# Altium project Motor_Control_Unit_2023_Urban.PrjPcb
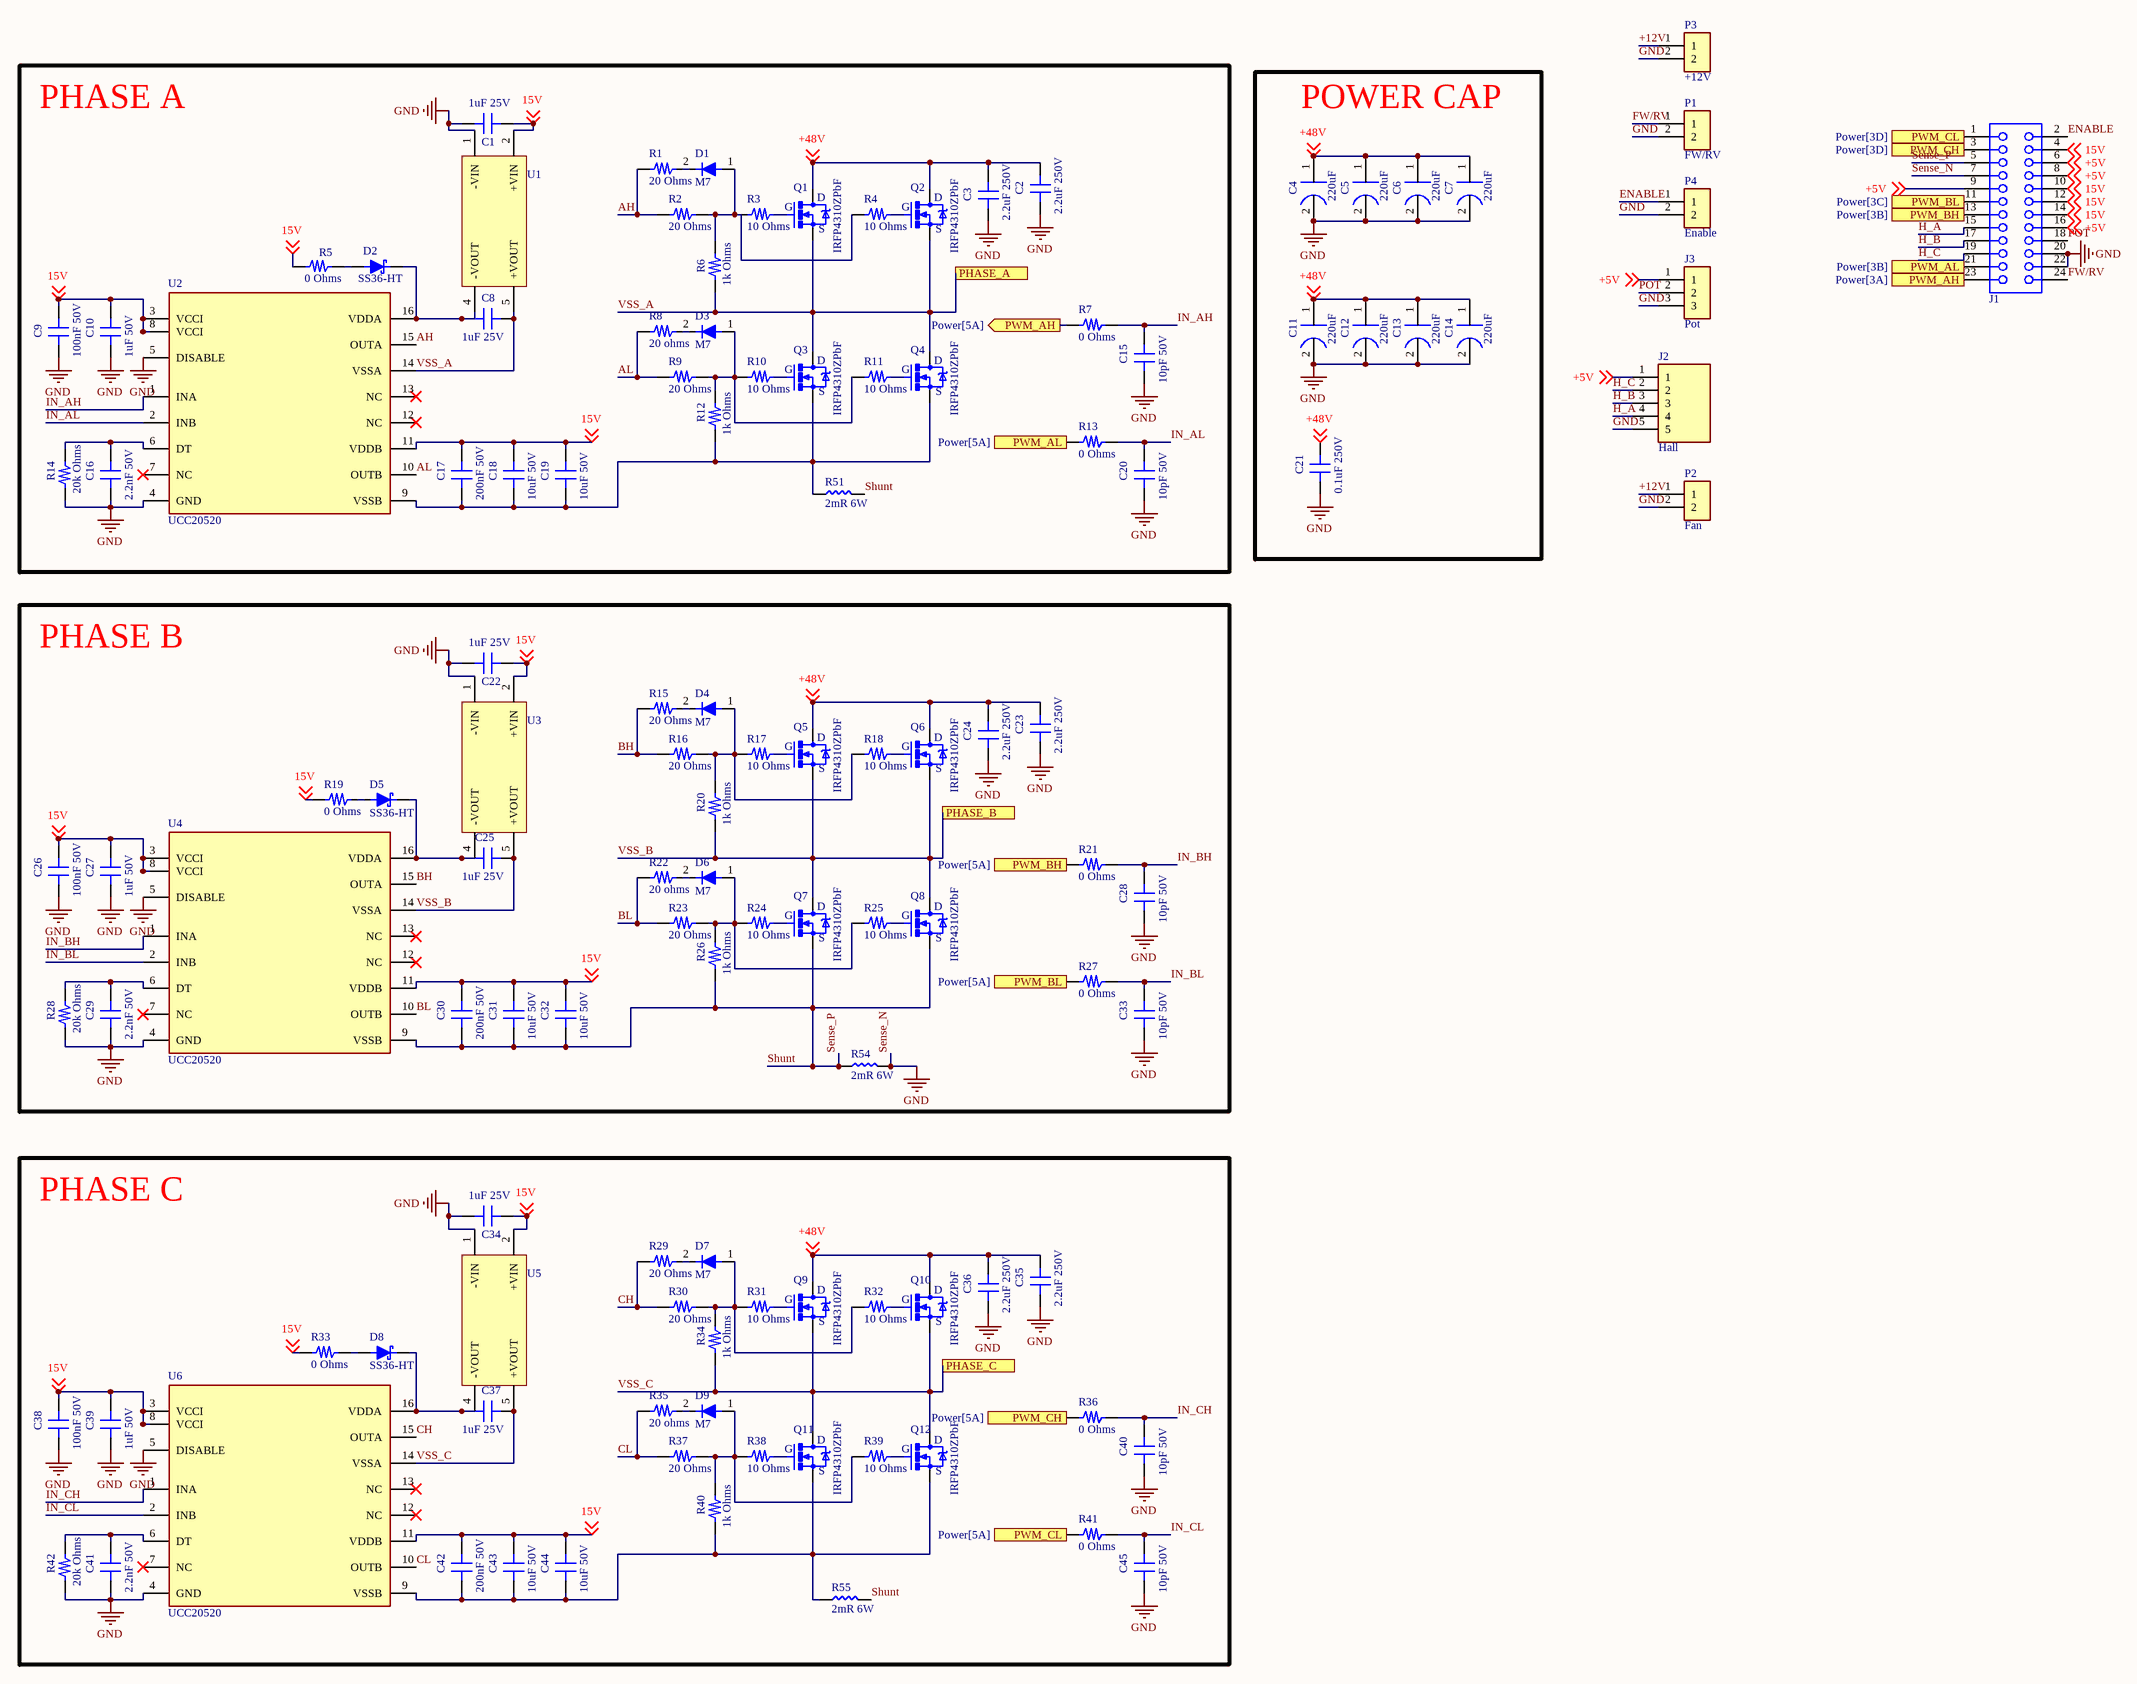
[diagram p0: Power.SchDoc]
2 sheets, 157 parts. Net scope: flat (ports and power ports of the same name join across sheets).
Board file: PCB.PcbDoc
Sheets:
  Power.SchDoc
  Regulator.SchDoc

## Sheet Power.SchDoc
size C; SheetNumber: 1; SheetTotal: 2

### Parts
C1  1uF 25V  [0805_CAP]
C2  2.2uF 250V  [0805_CAP]
C3  2.2uF 250V  [0805_CAP]
C4  220uF  [220uF 100V Cap]
C5  220uF  [220uF 100V Cap]
C6  220uF  [220uF 100V Cap]
C7  220uF  [220uF 100V Cap]
C8  1uF 25V  [0805_CAP]
C9  100nF 50V  [0805_CAP]
C10  1uF 50V  [0805_CAP]
C11  220uF  [220uF 100V Cap]
C12  220uF  [220uF 100V Cap]
C13  220uF  [220uF 100V Cap]
C14  220uF  [220uF 100V Cap]
C15  10pF 50V  [0805_CAP]
C16  2.2nF 50V  [0805_CAP]
C17  200nF 50V  [0805_CAP]
C18  10uF 50V  [0805_CAP]
C19  10uF 50V  [0805_CAP]
C20  10pF 50V  [0805_CAP]
C21  0.1uF 250V  [0805_CAP]
C22  1uF 25V  [0805_CAP]
C23  2.2uF 250V  [0805_CAP]
C24  2.2uF 250V  [0805_CAP]
C25  1uF 25V  [0805_CAP]
C26  100nF 50V  [0805_CAP]
C27  1uF 50V  [0805_CAP]
C28  10pF 50V  [0805_CAP]
C29  2.2nF 50V  [0805_CAP]
C30  200nF 50V  [0805_CAP]
C31  10uF 50V  [0805_CAP]
C32  10uF 50V  [0805_CAP]
C33  10pF 50V  [0805_CAP]
C34  1uF 25V  [0805_CAP]
C35  2.2uF 250V  [0805_CAP]
C36  2.2uF 250V  [0805_CAP]
C37  1uF 25V  [0805_CAP]
C38  100nF 50V  [0805_CAP]
C39  1uF 50V  [0805_CAP]
C40  10pF 50V  [0805_CAP]
C41  2.2nF 50V  [0805_CAP]
C42  200nF 50V  [0805_CAP]
C43  10uF 50V  [0805_CAP]
C44  10uF 50V  [0805_CAP]
C45  10pF 50V  [0805_CAP]
D1  M7  [DIOM5025X220N]
D2  SS36-HT  [DO-214AB]
D3  M7  [DIOM5025X220N]
D4  M7  [DIOM5025X220N]
D5  SS36-HT  [DO-214AB]
D6  M7  [DIOM5025X220N]
D7  M7  [DIOM5025X220N]
D8  SS36-HT  [DO-214AB]
D9  M7  [DIOM5025X220N]
J1  61302421821  [61302421821]  (value not drawn)
J2  Hall  [TE_282837-5]
J3  Pot  [TE_282837-3]
P1  FW/RV  [TE_282837-2]
P2  Fan  [TE_282837-2]
P3  +12V  [TE_282837-2]
P4  Enable  [TE_282837-2]
Q1  IRFP4310ZPbF  [TO-247]
Q2  IRFP4310ZPbF  [TO-247]
Q3  IRFP4310ZPbF  [TO-247]
Q4  IRFP4310ZPbF  [TO-247]
Q5  IRFP4310ZPbF  [TO-247]
Q6  IRFP4310ZPbF  [TO-247]
Q7  IRFP4310ZPbF  [TO-247]
Q8  IRFP4310ZPbF  [TO-247]
Q9  IRFP4310ZPbF  [TO-247]
Q10  IRFP4310ZPbF  [TO-247]
Q11  IRFP4310ZPbF  [TO-247]
Q12  IRFP4310ZPbF  [TO-247]
R1  20 Ohms  [0805_RES]
R2  20 Ohms  [0805_RES]
R3  10 Ohms  [0805_RES]
R4  10 Ohms  [0805_RES]
R5  0 Ohms  [0805_RES]
R6  1k Ohms  [0805_RES]
R7  0 Ohms  [0805_RES]
R8  20 ohms  [0805_RES]
R9  20 Ohms  [0805_RES]
R10  10 Ohms  [0805_RES]
R11  10 Ohms  [0805_RES]
R12  1k Ohms  [0805_RES]
R13  0 Ohms  [0805_RES]
R14  20k Ohms  [0805_RES]
R15  20 Ohms  [0805_RES]
R16  20 Ohms  [0805_RES]
R17  10 Ohms  [0805_RES]
R18  10 Ohms  [0805_RES]
R19  0 Ohms  [0805_RES]
R20  1k Ohms  [0805_RES]
R21  0 Ohms  [0805_RES]
R22  20 ohms  [0805_RES]
R23  20 Ohms  [0805_RES]
R24  10 Ohms  [0805_RES]
R25  10 Ohms  [0805_RES]
R26  1k Ohms  [0805_RES]
R27  0 Ohms  [0805_RES]
R28  20k Ohms  [0805_RES]
R29  20 Ohms  [0805_RES]
R30  20 Ohms  [0805_RES]
R31  10 Ohms  [0805_RES]
R32  10 Ohms  [0805_RES]
R33  0 Ohms  [0805_RES]
R34  1k Ohms  [0805_RES]
R35  20 ohms  [0805_RES]
R36  0 Ohms  [0805_RES]
R37  20 Ohms  [0805_RES]
R38  10 Ohms  [0805_RES]
R39  10 Ohms  [0805_RES]
R40  1k Ohms  [0805_RES]
R41  0 Ohms  [0805_RES]
R42  20k Ohms  [0805_RES]
R51  2mR 6W  [3920]
R54  2mR 6W  [3920]
R55  2mR 6W  [3920]
U1  5Vin, 15Vout  [WPME-FISM_SMT-8_L12.75W10.7H6.95]  (value not drawn)
U2  UCC20520  [UCC20520]
U3  5Vin, 15Vout  [WPME-FISM_SMT-8_L12.75W10.7H6.95]  (value not drawn)
U4  UCC20520  [UCC20520]
U5  5Vin, 15Vout  [WPME-FISM_SMT-8_L12.75W10.7H6.95]  (value not drawn)
U6  UCC20520  [UCC20520]

### Ports
PHASE_A, PHASE_B, PHASE_C, PWM_AH (out, see Power[3A]), PWM_AH (out, see Power[5A]), PWM_AL (out, see Power[3B]), PWM_AL (out, see Power[5A]), PWM_BH (out, see Power[3B]), PWM_BH (out, see Power[5A]), PWM_BL (out, see Power[3C]), PWM_BL (out, see Power[5A]), PWM_CH (out, see Power[3D]), PWM_CH (out, see Power[5A]), PWM_CL (out, see Power[3D]), PWM_CL (out, see Power[5A])

### Nets
GND: C1.2 C2.1 C3.1 C4.2 C5.2 C6.2 C7.2 C9.1 C10.1 C11.2 C12.2 C13.2 C14.2 C15.1 C16.1 C20.1 C21.1 C22.2 C23.1 C24.1 C26.1 C27.1 C28.1 C29.1 C33.1 C34.2 C35.1 C36.1 C38.1 C39.1 C40.1 C41.1 C45.1 J1.7 J1.20 J1.22 J2.5 J3.3 P1.2 P2.2 P3.2 P4.2 R14.1 R28.1 R42.1 R54.2 U1.1(-VIN) U2.4(GND) U2.5(DISABLE) U3.1(-VIN) U4.4(GND) U4.5(DISABLE) U5.1(-VIN) U6.4(GND) U6.5(DISABLE)  [also labelled Sense_N]
15V: C1.1 C9.2 C10.2 C17.2 C18.2 C19.2 C22.1 C26.2 C27.2 C30.2 C31.2 C32.2 C34.1 C38.2 C39.2 C42.2 C43.2 C44.2 J1.4 J1.10 J1.12 J1.14 R5.1 R19.1 R33.1 U1.2(+VIN) U2.3(VCCI) U2.8(VCCI) U2.11(VDDB) U3.2(+VIN) U4.3(VCCI) U4.8(VCCI) U4.11(VDDB) U5.2(+VIN) U6.3(VCCI) U6.8(VCCI) U6.11(VDDB) ; off-sheet 15V  [project net \]
+5V: J1.6 J1.8 J1.9 J1.16 J2.1 J3.1 ; off-sheet +5V
+12V: P2.1 P3.1
+48V: C2.2 C3.2 C4.1 C5.1 C6.1 C7.1 C11.1 C12.1 C13.1 C14.1 C21.2 C23.2 C24.2 C35.2 C36.2 Q1.2(D) Q2.2(D) Q5.2(D) Q6.2(D) Q9.2(D) Q10.2(D) ; off-sheet +48V
AH: R1.1 R2.1 U2.15(OUTA)
AL: R8.1 R9.1 U2.10(OUTB)
BH: R15.1 R16.1 U4.15(OUTA)
BL: R22.1 R23.1 U4.10(OUTB)
CH: R29.1 R30.1 U6.15(OUTA)
CL: R35.1 R37.1 U6.10(OUTB)
ENABLE: J1.2 P4.1
FW/RV: J1.24 P1.1
H_A: J1.15 J2.4
H_B: J1.17 J2.3
H_C: J1.19 J2.2
IN_AH: C15.2 R7.2 U2.1(INA)
IN_AL: C20.2 R13.2 U2.2(INB)
IN_BH: C28.2 R21.2 U4.1(INA)
IN_BL: C33.2 R27.2 U4.2(INB)
IN_CH: C40.2 R36.2 U6.1(INA)
IN_CL: C45.2 R41.2 U6.2(INB)
POT: J1.18 J3.2
Sense_P: C30.1 C31.1 C32.1 J1.5 Q7.3(S) Q8.3(S) R26.1 R51.2 R54.1 R55.2 U4.9(VSSB)  [also labelled Shunt]
VSS_A: C8.1 Q1.3(S) Q2.3(S) Q3.2(D) Q4.2(D) R6.1 U1.5(+VOUT) U2.14(VSSA) ; port PHASE_A
VSS_B: C25.1 Q5.3(S) Q6.3(S) Q7.2(D) Q8.2(D) R20.1 U3.5(+VOUT) U4.14(VSSA) ; port PHASE_B
VSS_C: C37.1 Q9.3(S) Q10.3(S) Q11.2(D) Q12.2(D) R34.1 U5.5(+VOUT) U6.14(VSSA) ; port PHASE_C
NetC8_2: C8.2 D2.2 U1.4(-VOUT) U2.16(VDDA)
NetC16_2: C16.2 R14.2 U2.6(DT)
NetC17_1: C17.1 C18.1 C19.1 Q3.3(S) Q4.3(S) R12.1 R51.1 U2.9(VSSB)
NetC25_2: C25.2 D5.2 U3.4(-VOUT) U4.16(VDDA)
NetC29_2: C29.2 R28.2 U4.6(DT)
NetC37_2: C37.2 D8.2 U5.4(-VOUT) U6.16(VDDA)
NetC41_2: C41.2 R42.2 U6.6(DT)
NetC42_1: C42.1 C43.1 C44.1 Q11.3(S) Q12.3(S) R40.1 R55.1 U6.9(VSSB)
NetD1_1: D1.1 R2.2 R3.1 R4.1 R6.2
NetD1_2: D1.2 R1.2
NetD2_1: D2.1 R5.2
NetD3_1: D3.1 R9.2 R10.1 R11.1 R12.2
NetD3_2: D3.2 R8.2
NetD4_1: D4.1 R16.2 R17.1 R18.1 R20.2
NetD4_2: D4.2 R15.2
NetD5_1: D5.1 R19.2
NetD6_1: D6.1 R23.2 R24.1 R25.1 R26.2
NetD6_2: D6.2 R22.2
NetD7_1: D7.1 R30.2 R31.1 R32.1 R34.2
NetD7_2: D7.2 R29.2
NetD8_1: D8.1 R33.2
NetD9_1: D9.1 R37.2 R38.1 R39.1 R40.2
NetD9_2: D9.2 R35.2
NetJ1_1: J1.1 R41.1 ; port PWM_CL
NetJ1_3: J1.3 R36.1 ; port PWM_CH
NetJ1_11: J1.11 R27.1 ; port PWM_BL
NetJ1_13: J1.13 R21.1 ; port PWM_BH
NetJ1_21: J1.21 R13.1 ; port PWM_AL
NetJ1_23: J1.23 R7.1 ; port PWM_AH
NetQ1_1: Q1.1(G) R3.2
NetQ2_1: Q2.1(G) R4.2
NetQ3_1: Q3.1(G) R10.2
NetQ4_1: Q4.1(G) R11.2
NetQ5_1: Q5.1(G) R17.2
NetQ6_1: Q6.1(G) R18.2
NetQ7_1: Q7.1(G) R24.2
NetQ8_1: Q8.1(G) R25.2
NetQ9_1: Q9.1(G) R31.2
NetQ10_1: Q10.1(G) R32.2
NetQ11_1: Q11.1(G) R38.2
NetQ12_1: Q12.1(G) R39.2

Not connected (* = marked no-connect by the designer): U2 7(NC)* 12(NC)* 13(NC)*; U4 7(NC)* 12(NC)* 13(NC)*; U6 7(NC)* 12(NC)* 13(NC)*

### Notes on the sheet
- PHASE A
- POWER CAP
- PHASE B
- PHASE C

### Library data of the parts
C1 C22 C34 = CAP_0805: 1-3.3 uF polyster film cap; Value: 1uF 25V
C2 C3 C9 C17 C18 C21 C23 C24 C26 C30 C31 C35 C36 C38 C42 C43 = CAP_0805: MLCC
  C2 C3 C23 C24 C35 C36: Value: 2.2uF 250V
  C9 C26 C38: Value: 100nF 50V
  C17 C30 C42: Value: 200nF 50V
  C18 C31 C43: Value: 10uF 50V
  C21: Value: 0.1uF 250V
C4-C7 C11-C14 = 220uF 100V Cap
C8 C16 C25 C29 C37 C41 = CAP_0805
  C8 C25 C37: Value: 1uF 25V
  C16 C29 C41: Value: 2.2nF 50V
C10 C19 C27 C32 C39 C44 = CAP_0805: tantalum or electrolytic
  C10 C27 C39: Value: 1uF 50V
  C19 C32 C44: Value: 10uF 50V
C15 C20 C28 C33 C40 C45 = CAP_0805: MLCC 10-100 pF; Value: 10pF 50V
D1 D3 D4 D6 D7 D9 = M7: M7-DC - DIODE STAND. Single 1A 1000V SMT DO214AC (SMA); PartNumber: M7; ComponentLink1Description: Datasheet; ComponentLink1URL: https://cdn.ozdisan.com/ETicaret_Dosya/339012_7315810.pdf; ComponentLink2Description: Özdisan; ComponentLink2URL: https://ozdisan.com/guc-yari-iletkenleri/diyotlar-modul-diyotlar-ve-dogrultucular/genel-amacli-diyotlar/M7-DC; Package: DO214AC (SMA)
D2 D5 D8 = SS36-214AB-HT: Schottky Diode; PartNumber: SS36-HT; ComponentLink1Description: Özdisan; ComponentLink1URL: https://ozdisan.com/guc-yari-iletkenleri/diyotlar-modul-diyotlar-ve-dogrultucular/schottky-diyotlar/SS36-214AB-HT/475999; ComponentLink2Description: Datasheet; ComponentLink2URL: https://cdn.ozdisan.com/ETicaret_Dosya/475999_7494647.pdf
J1 = 61302421821: WR-PHD Socket Header, THT, Vertical, pitch 2.54mm, 2 Row, 24P; Manufacturer: Wurth Elektronik; Contact Resistance: 20mOhm; Rated Current: 3A; Working Voltage: 250V; Withstanding Voltage: 500V; Manufacturer Part Number: 61302421821; Category: Board-to-Board Connectors; Match Code: WR-PHD; ComponentLink1Description: Website Link; ComponentLink1URL: https://www.we-online.com/redexpert/article/61302421821?ad; ComponentLink2Description: Datasheet Link; ComponentLink2URL: https://www.we-online.com/redexpert/spec/61302421821?ad; Mount: Through Hole; Operating Temperature Max: 125°C; Operating Temperature Min: -40°C; Packaging: Tray; Gender: Socket Header; Number of Pins: 24; Number of Rows: 2; Orientation: Vertical; Pitch: 2.54mm
J2 = 282837-5: TERMI-BLOK PCB MOUNT 5P; MF: TE Connectivity; MP: 282837-5; Price: None; Package: None; Value: *; TE_purchase_URL: https://www.te.com/usa-en/product-282837-5.html?te_bu=Cor&te_type=disp&te_campaign=seda_glo_cor-seda-global-disp-prtnr-fy19-seda-model-bom-cta_sma-317_1&elqCampaignId=32493; Availability: Unavailable; EU_RoHS_Compliance: Compliant with Exemptions; SnapEDA_Link: https://www.snapeda.com/parts/282837-5/TE%20Connectivity%20AMP%20Connectors/view-part/532953/?ref=snap
J3 = 282837-3: TERMI-BLOK PCB MOUNT 3P; Availability: Unavailable; Package: None; MP: 282837-3; Value: *; Price: None
P1-P4 = 282837-2: Ð Ð°Ð·ÑŠÐµÐ¼Ð½Ñ‹Ðµ ÐºÐ»ÐµÐ¼Ð¼Ð½Ñ‹Ðµ ÐºÐ¾Ð»Ð¾Ð´ÐºÐ¸ Ð Ð¾Ð·ÐµÑ‚ÐºÐ° 2 Ð¿Ð¾Ð»Ð¾Ð¶ÐµÐ½Ð¸Ñ 5,08 Ð¼Ð¼ ÐŸÑ€Ð¸Ð¿Ð¾Ð¹ Ð¿Ñ€ÑÐ¼Ð¾Ð¹ Ñ‡ÐµÑ€ÐµÐ· Ð¾Ñ‚Ð²ÐµÑ€ÑÑ‚Ð¸Ðµ 13,5 Ð / ÐºÐ¾Ð½Ñ‚Ð°ÐºÑ‚; MF: TE Connectivity; SnapEDA_Link: https://www.snapeda.com/parts/282837-2/TE+Connectivity+AMP+Connectors/view-part/?ref=snap; Price: None; Check_prices: https://www.snapeda.com/parts/282837-2/TE+Connectivity+AMP+Connectors/view-part/?ref=eda; Purchase-URL: https://pricing.snapeda.com/search/part/282837-2/?ref=eda; MP: 282837-2; Value: *; Availability: In Stock; Package: None
Q1-Q12 = IRFP4310ZPbF: IRFP4310ZPBF - MOSFET DIS.120A 100V N-CH TO247AC HEXFET THT; Current Rate: 120A; Voltage Rate: 100V; ComponentLink1Description: Özdisan; ComponentLink1URL: https://ozdisan.com/Product/Detail/480417/IRFP4310ZPBF; ComponentLink2Description: Datasheet; ComponentLink2URL: https://cdn.ozdisan.com/ETicaret_Dosya/480417_1248700.pdf; PartValue: IRFP4310ZPbF
R1-R4 R6 R8-R12 R14-R18 R20 R22-R26 R28-R32 R34 R35 R37-R40 R42 = RES_0805: 0805; Power: 1/8 W
  R1 R2 R9 R15 R16 R23 R29 R30 R37: Value: 20 Ohms
  R3 R4 R10 R11 R17 R18 R24 R25 R31 R32 R38 R39: Value: 10 Ohms
  R6 R12 R20 R26 R34 R40: Value: 1k Ohms
  R8 R22 R35: Value: 20 ohms
  R14 R28 R42: Value: 20k Ohms
R5 R19 R33 = RES_0805: 0805                                                      1-20 ohms; Power: 1/8 W; Value: 0 Ohms
R7 R13 R21 R27 R36 R41 = RES_0805: 0805 0-100 OHMS; Power: 1/8 W; Value: 0 Ohms
R51 R54 R55 = Shunt: 3920
U1 U3 U5 = 176861512: WPME-FISM Fixed Isolated Module, SMT-8, 5Vin, 15Vout; Manufacturer: Wurth Elektronik; Input Voltage: 5V; Input Voltage Min: 4.5V; Input Voltage Max: 5.5V; Isolation Voltage: 2000V; Output Power: 1W; Output Voltage: 15V; Manufacturer Part Number: 176861512; Category: Isolated Converter; Match Code: WPME-FISM; ComponentLink1Description: Website Link; ComponentLink1URL: https://www.we-online.com/redexpert/article/176861512?ad; ComponentLink2Description: Datasheet Link; ComponentLink2URL: https://www.we-online.com/redexpert/spec/176861512?ad; Mount: Surface Mount; Operating Temperature Max: 100°C; Operating Temperature Min: -40°C; Packaging: Tape and Reel; Case/Size Code: SMT-8; Length: 12.75mm; Width: 10.7mm; Height: 6.95mm
U2 U4 U6 = UCC21520

## Sheet Regulator.SchDoc
size A; SheetNumber: 2; SheetTotal: 2
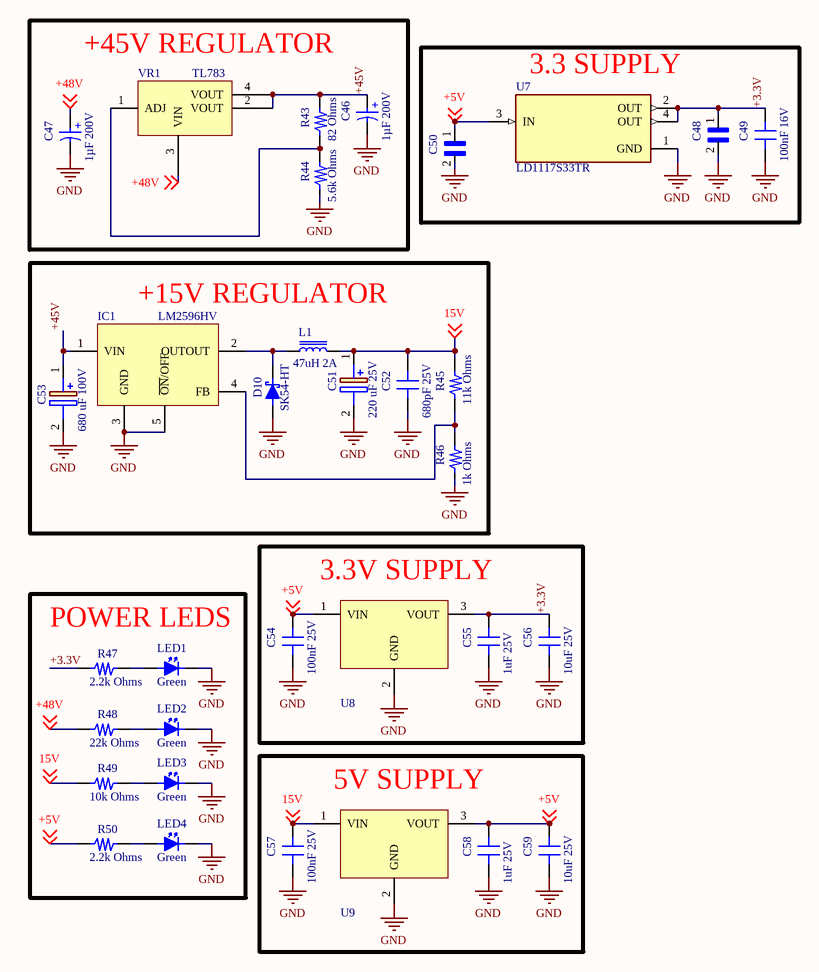
[diagram p1: Regulator.SchDoc]

### Parts
C46  1µF 200V  [WCAP-ATG5_D5H11]
C47  1µF 200V  [WCAP-ATG5_D5H11]
C48  (no value)  [CAPC3216X110N]
C49  100nF 16V  [0805_CAP]
C50  (no value)  [CAPC3216X110N]
C51  220 uF 25V  [CAPAE1030X1060N]
C52  680pF 25V  [0805_CAP]
C53  680 uF 100V  [CAPAE1030X1060N]
C54  100nF 25V  [0805_CAP]
C55  1uF 25V  [0805_CAP]
C56  10uF 25V  [0805_CAP]
C57  100nF 25V  [0805_CAP]
C58  1uF 25V  [0805_CAP]
C59  10uF 25V  [0805_CAP]
D10  SK54-HT  [DO-214AB]
IC1  LM2596HV  [TO-263-5]
L1  47uH 2A  [BOURNS SRR1280]
LED1  Green  [0805LED]
LED2  Green  [0805LED]
LED3  Green  [0805LED]
LED4  Green  [0805LED]
R43  82 Ohms  [0805_RES]
R44  5.6k Ohms  [0805_RES]
R45  11k Ohms  [0805_RES]
R46  1k Ohms  [0805_RES]
R47  2.2k Ohms  [0805_RES]
R48  22k Ohms  [0805_RES]
R49  10k Ohms  [0805_RES]
R50  2.2k Ohms  [0805_RES]
U7  LD1117S33TR  [SOT230P700X180-4N]
U8  7-28Vin, 3.3Vout, 1Aout  [WPME-FDSM_SIP-3_L11.6W8.5H10.5]  (value not drawn)
U9  7-28Vin, 3.3Vout, 1Aout  [WPME-FDSM_SIP-3_L11.6W8.5H10.5]  (value not drawn)
VR1  TL783  [TL783]

### Nets
GND: C46.2(N) C47.2(N) C48.2 C49.1 C50.2 C51.2(-) C52.1 C53.2(-) C54.1 C55.1 C56.1 C57.1 C58.1 C59.1 D10.1 IC1.3(GND) IC1.5(~{ON}/OFF) LED1.2(Cathode(-)) LED2.2(Cathode(-)) LED3.2(Cathode(-)) LED4.2(Cathode(-)) R44.2 R46.2 U7.1(GND) U8.2(GND) U9.2(GND)
+3.3V: C48.1 C49.2 C55.2 C56.2 R47.2 U7.2(OUT) U7.4(OUT) U8.3(VOUT)
+5V: C50.1 C54.2 C58.2 C59.2 R50.2 U7.3(IN) U8.1(VIN) U9.3(VOUT) ; off-sheet +5V
+45V: C46.1(P) C53.1(+) IC1.1(VIN) R43.1 VR1.2(VOUT) VR1.4(VOUT)
+48V: C47.1(P) R48.2 VR1.3(VIN) ; off-sheet +48V
\: C51.1(+) C52.2 C57.2 L1.2 R45.1 R49.2 U9.1(VIN) ; off-sheet 15V  [also labelled 15V]
NetD10_2: D10.2 IC1.2(OUTOUT) L1.1
NetIC1_4: IC1.4(FB) R45.2 R46.1
NetLED1_1: LED1.1(Anode(+)) R47.1
NetLED2_1: LED2.1(Anode(+)) R48.1
NetLED3_1: LED3.1(Anode(+)) R49.1
NetLED4_1: LED4.1(Anode(+)) R50.1
NetR43_2: R43.2 R44.1 VR1.1(ADJ)

### Notes on the sheet
- (near VR1) +45V REGULATOR
- (near U7) 3.3 SUPPLY
- +15V REGULATOR
- (near U8) 3.3V SUPPLY
- POWER LEDS
- (near U9) 5V SUPPLY
- (in symbol 860020772010) +

### Library data of the parts
C46 C47 = 860020772010: WCAP-ATG5 Aluminum Electrolytic Capacitor, Radial, THT, D5 x H11mm, 10µF, 63V; Manufacturer: Wurth Elektronik; Capacitance Tolerance: +/-20%; Dissipation Factor: 9%; Endurance: 2000h; Leakage Current: 6.3µA; Ripple Current: 42mA; Technical Reference: ATDC110100M063DSPA3B000; Manufacturer Part Number: 860020772010; Category: Aluminum Electrolytic Capacitors; Match Code: WCAP-ATG5; ComponentLink1Description: Website Link; ComponentLink1URL: https://www.we-online.com/redexpert/article/860020772010?ad; ComponentLink2Description: Datasheet Link; ComponentLink2URL: https://www.we-online.com/redexpert/spec/860020772010?ad; Mount: Through Hole; Operating Temperature Max: 105°C; Operating Temperature Min: -40°C; Packaging: Ammo Pack; Height: 11mm; Diameter: 5mm; Rated Voltage (DC): 63V; Capacitance: 1µF 200V
C48 C50 = C1206C105K5RACTU: 1206 Tantalum 10 uF 16V; Value: 10uF; MF: KEMET; MP: C1206C105K5RACTU; Package: 3216 KEMET; SnapEDA_Link: https://www.snapeda.com/parts/C1206C105K5RACTU/KEMET/view-part/357507/?ref=snap; Digi-Key_Part_Number: 399-8147-1-ND; Digi-Key_Purchase_URL: https://www.digikey.com/product-detail/en/kemet/C1206C105K5RACTU/399-8147-1-ND/3471870?utm_source=snapeda&utm_medium=aggregator&utm_campaign=symbol
C49 C52 C54-C59 = CAP_0805
  C49: Value: 100nF 16V
  C52: Value: 680pF 25V
  C54 C57: Value: 100nF 25V
  C55 C58: Value: 1uF 25V
  C56 C59: Value: 10uF 25V
C51 C53 = CK1H221M-CRG10: Capacitor Polarised; Manufacturer_Name: SEMTECH; Datasheet Link: https://datasheet.lcsc.com/szlcsc/1810281207_ST-Semtech-CK1H221M-CRG10_C131159.pdf; Height: 10.6mm; Manufacturer_Part_Number: CK1H221M-CRG10
D10 = SS36-214AB-HT: Schottky Diode; PartNumber: SK54-HT; ComponentLink1Description: Özdisan; ComponentLink1URL: https://ozdisan.com/guc-yari-iletkenleri/diyotlar-modul-diyotlar-ve-dogrultucular/schottky-diyotlar/SS36-214AB-HT/475999; ComponentLink2Description: Datasheet; ComponentLink2URL: https://cdn.ozdisan.com/ETicaret_Dosya/475999_7494647.pdf
IC1 = LM2596HV: Integrated Circuit; Manufacturer_Name: Texas Instruments; Datasheet Link: http://www.ti.com/lit/ds/symlink/lm2596.pdf; PartValue: LM2596HV; Mouser Part Number: 926-LM2596S-12; Mouser Price/Stock: https://www.mouser.co.uk/ProductDetail/Texas-Instruments/LM2596S-12?qs=X1J7HmVL2ZEK1FPBBSYJCA%3D%3D; Arrow Part Number: LM2596S-12; Arrow Price/Stock: https://www.arrow.com/en/products/lm2596s-12/texas-instruments
L1 = Inductor: FIXED IND 47UH 2.9A 80 MOHM SMD; Value: 47uH 2A
LED1-LED4 = LED: 0805
R43-R50 = RES_0805: 0805; Power: 1/8 W
  R43: Value: 82 Ohms
  R44: Value: 5.6k Ohms
  R45: Value: 11k Ohms
  R46: Value: 1k Ohms
  R47 R50: Value: 2.2k Ohms
  R48: Value: 22k Ohms
  R49: Value: 10k Ohms
U7 = LD1117S33TR: Linear Voltage Regulator IC Positive Fixed 1 Output 800mA SOT-223; MF: STMicroelectronics; Value: *; SnapEDA_Link: https://www.snapeda.com/parts/LD1117S33TR/STMicroelectronics/view-part/?ref=snap; MP: LD1117S33TR; Purchase-URL: https://pricing.snapeda.com/search/part/LD1117S33TR/?ref=eda; Check_prices: https://www.snapeda.com/parts/LD1117S33TR/STMicroelectronics/view-part/?ref=eda; Availability: In Stock; Price: None; Package: TO-261-4 STMicroelectronics
U8 U9 = 173010378: WPME-FDSM Fixed Step Down Regulator Module, THT, SIP-3, 7-28Vin, 3.3Vout, 1Aout; Manufacturer: Wurth Elektronik; Input Voltage Min: 7V; Input Voltage Max: 28V; Output Current: 1A; Output Voltage: 3.3V; Manufacturer Part Number: 173010378; Category: Step Down Converter; Match Code: WPME-FDSM; ComponentLink1Description: Website Link; ComponentLink1URL: https://www.we-online.com/redexpert/article/173010378?ad; ComponentLink2Description: Datasheet Link; ComponentLink2URL: https://www.we-online.com/redexpert/spec/173010378?ad; Mount: Through Hole; Operating Temperature Max: 85°C; Operating Temperature Min: -40°C; Packaging: Tube; Case/Size Code: SIP-3; Length: 11.6mm; Width: 8.5mm; Height: 10.5mm
VR1 = TL783/SMD

## Nets that join several sheets
GND: Power (55 pins), Regulator (26 pins)
+5V: Power (6 pins), Regulator (8 pins)
+48V: Power (21 pins), Regulator (C47.1 R48.2 VR1.3)
\: Power (37 pins), Regulator (7 pins)